# EAGLE design Preflightv1_18_2_12 (EAGLE 5.10)
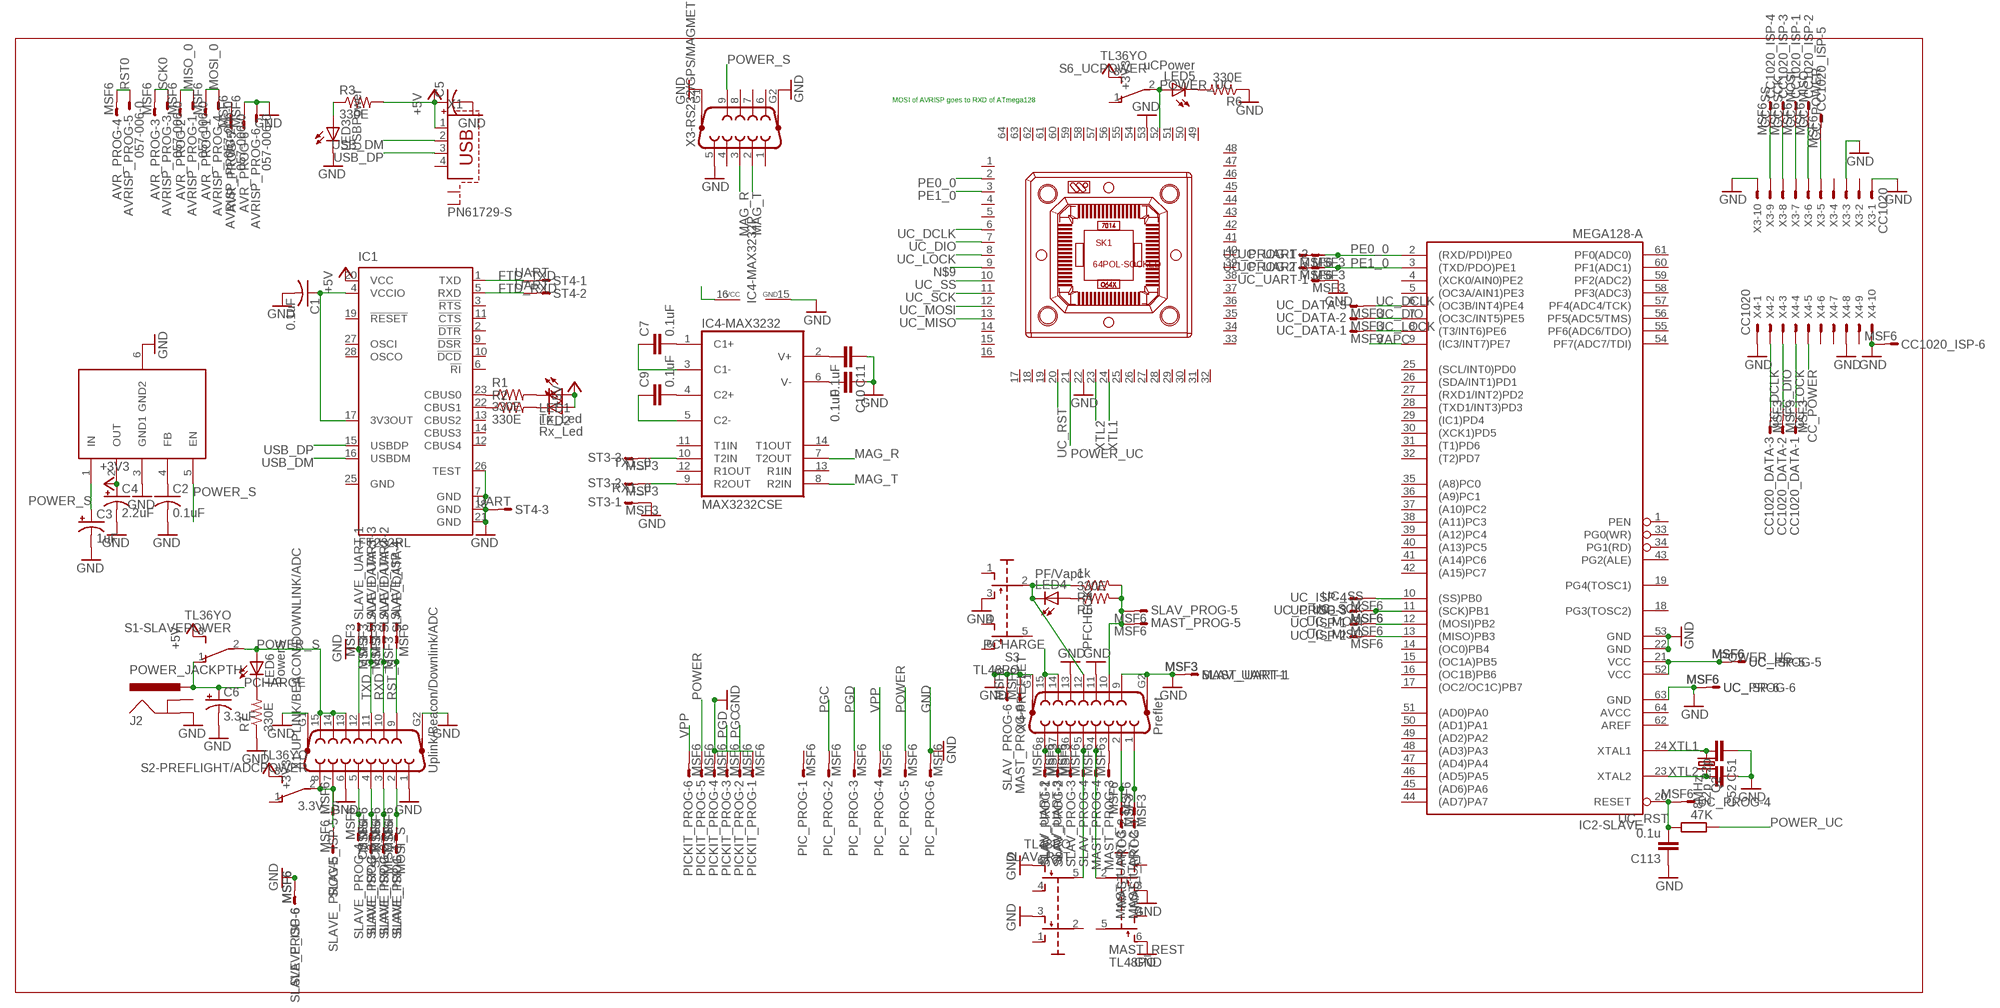
[diagram p0: schematic, sheet 1]

## Parts
AVR_PROG  MSF6  [MSF6]
AVRISP_PROG  057-006-0  ML6LE  [ML6L]
C1  0.1uF  C-USC1206K  [C1206K]
C2  0.1uF  C-USC1206K  [C1206K]
C3  1uF  CPOL-USCT3528  [CT3528]
C4  2.2uF  CPOL-USC/6032-28R  [C/6032-28R]
C5  CPOL-US153CLV-0405  [153CLV-0405]
C6  3.3uF  CPOL-US153CLV-0605  [153CLV-0605]
C7  0.1uF  C-EUC1206  [C1206]
C9  0.1uF  C-EUC1206  [C1206]
C10  0.1uF  C-EUC1206  [C1206]
C11  0.1uF  C-EUC1206  [C1206]
C51  22p  C-EUC1206  [C1206]
C52  22p  C-EUC1206  [C1206]
C113  0.1u  C-EUC1206  [C1206]
CC1020_DATA  MSF3  [MSF3]
CC1020_ISP  MSF6  [MSF6]
IC1  FT232RL  [SSOP28]
IC2-SLAVE  MEGA128-A  [TQFP64]
IC4-MAX3232  MAX3232CSE  [SO16]
J2  POWER_JACKPTH  [POWER_JACK_PTH]
LED1  Tx_Led  LEDCHIPLED_1206  [CHIPLED_1206]
LED2  Rx_Led  LEDCHIPLED_1206  [CHIPLED_1206]
LED3  USBPower  LEDCHIPLED_1206  [CHIPLED_1206]
LED4  PF/Vapc  LEDCHIPLED_1206  [CHIPLED_1206]
LED5  uCPower  LEDCHIPLED_1206  [CHIPLED_1206]
LED6  PowerS  LEDCHIPLED_1206  [CHIPLED_1206]
MAST_PROG  MSF6  [MSF6]
MAST_REST  TL48PO  [TL4XPO]
MAST_UART  MSF3  [MSF3]
PIC_PROG  MSF6  [MSF6]
PICKIT_PROG  MSF6  [MSF6]
Q2  8MHz  CRYSTALHC49S  [HC49/S]
R1  330E  R-US_M1206  [M1206]
R2  330E  R-US_M1206  [M1206]
R3  330E  R-US_M1206  [M1206]
R4  1k  R-US_M1206  [M1206]
R5  330E  R-US_M1206  [M1206]
R6  330E  R-US_M1206  [M1206]
R7  330E  R-US_M1206  [M1206]
R113  47K  R-EU_M1206  [M1206]
S1-SLAVEPOWER  TL36YO  [TL3XYO]
S2-PREFLIGHT/ADCPOWER  TL36YO  [TL3XYO]
S3  TL48PO  [TL4XPO]
S6_UCPOWER  TL36YO  [TL3XYO]
SK1  64POL-SOCKED  [QFP-SOCKED-64]
SLAV_PROG  MSF6  [MSF6]
SLAV_RST  TL48PO  [TL4XPO]
SLAV_UART  MSF3  [MSF3]
SLAVE_DATA  MSF3  [MSF3]
SLAVE_ISP  MSF6  [MSF6]
SLAVE_PROG  MSF6  [MSF6]
SLAVE_UART  MSF3  [MSF3]
ST3  MSF3  [MSF3]
ST4  UART  MSF3  [MSF3]
U$1  TPS73633  [SOT-223-5]
UC_DATA  MSF3  [MSF3]
UC_ISP  MSF6  [MSF6]
UC_PROG  MSF6  [MSF6]
UC_UART  MSF3  [MSF3]
X1  PN61729-S  [PN61729-S]
X1-UPLINK/BEACON/DOWNLINK/ADC  Uplink/Beacon/Downlink/ADC  F15HP  [F15HP]
X3  CC1020  C-GRID-10-70543  [70543-10]
X3-RS232/GPS/MAGMET  F09HP  [F09HP]
X4  CC1020  C-GRID-10-70543  [70543-10]
X4-PREFLET  Preflet  F15HP  [F15HP]

## Nets
3.3V_S: MAST_PROG.5 R4.2 R5.2 S2-PREFLIGHT/ADCPOWER.2(P) SLAV_PROG.5 SLAVE_ISP.5 SLAVE_PROG.5 X1-UPLINK/BEACON/DOWNLINK/ADC.7 X1-UPLINK/BEACON/DOWNLINK/ADC.8 X4-PREFLET.10
3V3OUT: C1.1 IC1.4(VCCIO) IC1.17(3V3OUT) IC4-MAX3232.16(VCC)
+3V3 [Power]: C4.+ S2-PREFLIGHT/ADCPOWER.3(S) S6_UCPOWER.3(S) U$1.2(OUT)
+5V: C5.+ IC1.20(VCC) LED1.A LED2.A R3.2 S1-SLAVEPOWER.3(S) X1.1
CC_DCLK: CC1020_DATA.3 X4.2
CC_DIO: CC1020_DATA.2 X4.3
CC_LOCK: CC1020_DATA.1 X4.4
CC_MISO: CC1020_ISP.2 X3.6
CC_MOSI: CC1020_ISP.1 X3.7
CC_POWER [Power]: CC1020_ISP.5 X3.5 X4.5
CC_SCK: CC1020_ISP.3 X3.8
CC_SS: CC1020_ISP.4 X3.9
CS_S: SLAVE_PROG.4 X1-UPLINK/BEACON/DOWNLINK/ADC.5
FTD_RXD: IC1.5(RXD) ST4.2
FTD_TXD: IC1.1(TXD) ST4.1
GND [Power]: AVR_PROG.6 AVRISP_PROG.6 C1.2 C2.2 C3.- C4.- C5.- C6.- C10.1 C11.1 C51.1 C52.1 C113.1 CC1020_ISP.6 IC1.7(GND) IC1.18(GND) IC1.21(GND) IC1.26(TEST) IC2-SLAVE.22(GND) IC2-SLAVE.53(GND) IC2-SLAVE.63(GND) IC4-MAX3232.15(GND) J2.GND LED3.C MAST_PROG.6 MAST_REST.3(S) MAST_REST.6(S1) MAST_UART.1 PIC_PROG.6 PICKIT_PROG.1 PICKIT_PROG.4 R6.1 R7.1 S3.3(S) SK1.22 SK1.53 SLAV_PROG.6 SLAV_RST.3(S) SLAV_RST.6(S1) SLAV_UART.1 SLAVE_ISP.6 SLAVE_PROG.6 SLAVE_UART.1 ST3.1 ST4.3 U$1.3(GND1) U$1.6(GND2) UC_ISP.6 UC_PROG.6 UC_UART.1 X1-UPLINK/BEACON/DOWNLINK/ADC.1 X1-UPLINK/BEACON/DOWNLINK/ADC.6 X1-UPLINK/BEACON/DOWNLINK/ADC.12 X1-UPLINK/BEACON/DOWNLINK/ADC.G1 X1-UPLINK/BEACON/DOWNLINK/ADC.G2 X3-RS232/GPS/MAGMET.5 X3-RS232/GPS/MAGMET.G1 X3-RS232/GPS/MAGMET.G2 X3.1 X3.3 X3.10 X4-PREFLET.9 X4-PREFLET.11 X4-PREFLET.13 X4-PREFLET.G1 X4-PREFLET.G2 X4.1 X4.8 X4.10
MAG_R: IC4-MAX3232.7(T2OUT) X3-RS232/GPS/MAGMET.3
MAG_T: IC4-MAX3232.8(R2IN) X3-RS232/GPS/MAGMET.2
MISO_0: AVR_PROG.2 AVRISP_PROG.1
MISO_S: SLAVE_ISP.2 SLAVE_PROG.2 X1-UPLINK/BEACON/DOWNLINK/ADC.3
MOSI_0: AVR_PROG.1 AVRISP_PROG.4
MOSI_S: SLAVE_ISP.1 SLAVE_PROG.1 X1-UPLINK/BEACON/DOWNLINK/ADC.2
N$1: LED5.C R6.2
N$2: IC1.23(CBUS0) R1.1
N$3: LED1.C R1.2
N$4: IC1.22(CBUS1) R2.1
N$5: LED2.C R2.2
N$6: LED3.A R3.1
N$7: C2.1 U$1.4(FB)
N$8: LED4.A R5.1
N$9: SK1.9
N$10: SLAV_PROG.1 SLAV_UART.2 X4-PREFLET.8
N$11: SLAV_PROG.2 SLAV_UART.3 X4-PREFLET.7
N$12: SLAV_PROG.3 X4-PREFLET.6
N$13: SLAV_PROG.4 SLAV_RST.5(P1) X4-PREFLET.5
N$14: MAST_PROG.1 MAST_UART.2 X4-PREFLET.1
N$15: MAST_PROG.2 MAST_UART.3 X4-PREFLET.2
N$16: MAST_PROG.3 X4-PREFLET.3
N$17: MAST_PROG.4 MAST_REST.2(P) X4-PREFLET.4
N$19: AVR_PROG.5 AVRISP_PROG.2
N$23: LED6.C R7.2
N$29: C7.2 IC4-MAX3232.1(C1+)
N$30: C7.1 IC4-MAX3232.3(C1-)
N$31: C9.2 IC4-MAX3232.4(C2+)
N$32: C9.1 IC4-MAX3232.5(C2-)
N$33: C11.2 IC4-MAX3232.2(V+)
N$34: C10.2 IC4-MAX3232.6(V-)
PCHARGE [Power]: C6.+ J2.PWR S1-SLAVEPOWER.1(O) X4-PREFLET.14 X4-PREFLET.15
PE0_0: IC2-SLAVE.2((RXD/PDI)PE0) SK1.2 UC_PROG.1 UC_UART.2
PE1_0: IC2-SLAVE.3((TXD/PDO)PE1) SK1.3 UC_PROG.2 UC_UART.3
PFCHECK: LED4.C R4.1 S3.2(P) X4-PREFLET.12
PGC: PIC_PROG.2 PICKIT_PROG.2
PGD: PIC_PROG.3 PICKIT_PROG.3
POWER: PIC_PROG.5 PICKIT_PROG.5
POWER_S: C3.+ LED6.A S1-SLAVEPOWER.2(P) U$1.1(IN) U$1.5(EN) X1-UPLINK/BEACON/DOWNLINK/ADC.13 X1-UPLINK/BEACON/DOWNLINK/ADC.14 X1-UPLINK/BEACON/DOWNLINK/ADC.15 X3-RS232/GPS/MAGMET.9
POWER_UC [Power]: IC2-SLAVE.21(VCC) IC2-SLAVE.52(VCC) LED5.A R113.1 S6_UCPOWER.2(P) SK1.21 SK1.52 UC_ISP.5 UC_PROG.5
RST0: AVR_PROG.4 AVRISP_PROG.5
RST_S: SLAVE_DATA.1 SLAVE_ISP.4 X1-UPLINK/BEACON/DOWNLINK/ADC.9
RX1_0: IC4-MAX3232.9(R2OUT) ST3.2
RXD_S: SLAVE_DATA.2 SLAVE_UART.2 X1-UPLINK/BEACON/DOWNLINK/ADC.10
SCK0: AVR_PROG.3 AVRISP_PROG.3
SCK_S: SLAVE_ISP.3 SLAVE_PROG.3 X1-UPLINK/BEACON/DOWNLINK/ADC.4
TX1_0: IC4-MAX3232.10(T2IN) ST3.3
TXD_S: SLAVE_DATA.3 SLAVE_UART.3 X1-UPLINK/BEACON/DOWNLINK/ADC.11
UC_DCLK: IC2-SLAVE.6((OC3B/INT4)PE4) SK1.6 UC_DATA.3
UC_DIO: IC2-SLAVE.7((OC3C/INT5)PE5) SK1.7 UC_DATA.2
UC_LOCK: IC2-SLAVE.8((T3/INT6)PE6) SK1.8 UC_DATA.1
UC_MISO: IC2-SLAVE.13((MISO)PB3) SK1.13 UC_ISP.2
UC_MOSI: IC2-SLAVE.12((MOSI)PB2) SK1.12 UC_ISP.1
UC_RST: C113.2 IC2-SLAVE.20(RESET) R113.2 SK1.20 UC_PROG.4
UC_SCK: IC2-SLAVE.11((SCK)PB1) SK1.11 UC_ISP.3 UC_PROG.3
UC_SS: IC2-SLAVE.10((SS)PB0) SK1.10 UC_ISP.4
USB_DM: IC1.16(USBDM) X1.2
USB_DP: IC1.15(USBDP) X1.3
VAPC: IC2-SLAVE.9((IC3/INT7)PE7)
VPP: PIC_PROG.4 PICKIT_PROG.6
XTL1: C51.2 IC2-SLAVE.24(XTAL1) Q2.1 SK1.24
XTL2: C52.2 IC2-SLAVE.23(XTAL2) Q2.2 SK1.23
Unconnected: IC1.2(!DTR) IC1.3(!RTS) IC1.6(!RI) IC1.9(!DSR) IC1.10(!DCD) IC1.11(!CTS) IC1.12(CBUS4) IC1.13(CBUS2) IC1.14(CBUS3) IC1.19(!RESET) IC1.27(OSCI) IC1.28(OSCO) IC2-SLAVE.1(PEN) IC2-SLAVE.4((XCK0/AIN0)PE2) IC2-SLAVE.5((OC3A/AIN1)PE3) IC2-SLAVE.14((OC0)PB4) IC2-SLAVE.15((OC1A)PB5) IC2-SLAVE.16((OC1B)PB6) IC2-SLAVE.17((OC2/OC1C)PB7) IC2-SLAVE.18(PG3(TOSC2)) IC2-SLAVE.19(PG4(TOSC1)) IC2-SLAVE.25((SCL/INT0)PD0) IC2-SLAVE.26((SDA/INT1)PD1) IC2-SLAVE.27((RXD1/INT2)PD2) IC2-SLAVE.28((TXD1/INT3)PD3) IC2-SLAVE.29((IC1)PD4) IC2-SLAVE.30((XCK1)PD5) IC2-SLAVE.31((T1)PD6) IC2-SLAVE.32((T2)PD7) IC2-SLAVE.33(PG0(WR)) IC2-SLAVE.34(PG1(RD)) IC2-SLAVE.35((A8)PC0) IC2-SLAVE.36((A9)PC1) IC2-SLAVE.37((A10)PC2) IC2-SLAVE.38((A11)PC3) IC2-SLAVE.39((A12)PC4) IC2-SLAVE.40((A13)PC5) IC2-SLAVE.41((A14)PC6) IC2-SLAVE.42((A15)PC7) IC2-SLAVE.43(PG2(ALE)) IC2-SLAVE.44((AD7)PA7) IC2-SLAVE.45((AD6)PA6) IC2-SLAVE.46((AD5)PA5) IC2-SLAVE.47((AD4)PA4) IC2-SLAVE.48((AD3)PA3) IC2-SLAVE.49((AD2)PA2) IC2-SLAVE.50((AD1)PA1) IC2-SLAVE.51((AD0)PA0) IC2-SLAVE.54(PF7(ADC7/TDI)) IC2-SLAVE.55(PF6(ADC6/TDO)) IC2-SLAVE.56(PF5(ADC5/TMS)) IC2-SLAVE.57(PF4(ADC4/TCK)) IC2-SLAVE.58(PF3(ADC3)) IC2-SLAVE.59(PF2(ADC2)) IC2-SLAVE.60(PF1(ADC1)) IC2-SLAVE.61(PF0(ADC0)) IC2-SLAVE.62(AREF) IC4-MAX3232.11(T1IN) IC4-MAX3232.12(R1OUT) IC4-MAX3232.13(R1IN) IC4-MAX3232.14(T1OUT) J2.GNDBREAK MAST_REST.1(O) MAST_REST.4(O1) MAST_REST.5(P1) PIC_PROG.1 S2-PREFLIGHT/ADCPOWER.1(O) S3.1(O) S3.4(O1) S3.5(P1) S3.6(S1) S6_UCPOWER.1(O) SK1.1 SK1.4 SK1.5 SK1.14 SK1.15 SK1.16 SK1.17 SK1.18 SK1.19 SK1.25 SK1.26 SK1.27 SK1.28 SK1.29 SK1.30 SK1.31 SK1.32 SK1.33 SK1.34 SK1.35 SK1.36 SK1.37 SK1.38 SK1.39 SK1.40 SK1.41 SK1.42 SK1.43 SK1.44 SK1.45 SK1.46 SK1.47 SK1.48 SK1.49 SK1.50 SK1.51 SK1.54 SK1.55 SK1.56 SK1.57 SK1.58 SK1.59 SK1.60 SK1.61 SK1.62 SK1.63 SK1.64 SLAV_RST.1(O) SLAV_RST.2(P) SLAV_RST.4(O1) X1.4 X1.S1 X1.S2 X3-RS232/GPS/MAGMET.1 X3-RS232/GPS/MAGMET.4 X3-RS232/GPS/MAGMET.6 X3-RS232/GPS/MAGMET.7 X3-RS232/GPS/MAGMET.8 X3.2 X3.4 X4.6 X4.7 X4.9

## Notes on the sheet
- MOSI of AVRISP goes to RXD of ATmega128

## Power pins joined to a net without a drawn wire
AVCC: IC2-SLAVE.64(AVCC)
GND: IC1.25(GND)

## Library data of the parts
AVR_PROG CC1020_ISP MAST_PROG PIC_PROG PICKIT_PROG SLAV_PROG SLAVE_ISP SLAVE_PROG UC_ISP UC_PROG = con-lumberg:MSF6: MSF CONNECTOR
AVRISP_PROG = con-ml:ML6LE: HARTING
C1 C2 = rcl:C-US: CAPACITOR, American symbol
C3-C6 = rcl:CPOL-US: POLARIZED CAPACITOR, American symbol
C7 C9-C11 C51 C52 C113 = rcl:C-EU: CAPACITOR, European symbol
CC1020_DATA MAST_UART SLAV_UART SLAVE_DATA SLAVE_UART ST3 ST4 UC_DATA UC_UART = con-lumberg:MSF3: MSF CONNECTOR
IC1 = ftdichip:FT232R: Source: http://www.ftdichip.com/Documents/DataSheets/DS_FT232R_v104.pdf
IC2-SLAVE = satellite:MEGA128: MICROCONTROLLER 128 Kbytes FLASH 4 Kbytes SRAM 4 Kbytes EEPROM DUAL USART 8-channel 10 bit ADC Source: avr.lbr
IC4-MAX3232 = satellite:MAX3232*: True RS-232 Transceivers 3.0V to 5.5V, Low-Power up to 1Mbps, Using Four 0.1µF External Capacitors Source: http://pdfserv.maxim-ic.com/en/ds/MAX3222-MAX3241.pdf
J2 = SparkFun:POWER_JACK: Power Jack This is the standard 5.5mm barrel jack for power. The PTH is the most common, proven, reliable, footprint. All others are experimental. The Slot footprint only works if the mill layer is transmitted to the PCB fab house so be warned. Spark Fun Electronics SKU : PRT-00119. Mating wall wart : TOL-00298 (and others)
LED1-LED6 = led:LED: LED OSRAM: - CHIPLED LG R971, LG N971, LY N971, LG Q971, LY Q971, LO R971, LY R971 LH N974, LH R974 LS Q976, LO Q976, LY Q976 LO Q996 - Hyper CHIPLED LW Q18S LB Q993, LB Q99A, LB R99A - SideLED LS A670, LO A670, LY A670, LG A670, LP A670 LB A673, LV A673, LT A673, LW A673 LH A674 LY A675 LS A676, LA A676, LO A676, LY A676, LW A676 LS A679, LY A679, LG A679 - Hyper Micro SIDELED® LS Y876, LA Y876, LO Y876, LY Y876 LT Y87S - SmartLED LW L88C, LW L88S LB L89C, LB L89S, LG L890 LS L89K, LO L89K, LY L89K LS L896, LA L896, LO L896, LY L896 - TOPLED LS T670, LO T670, LY T670, LG T670, LP T670 LSG T670, LSP T670, LSY T670, LOP T670, LYG T670 LG T671, LOG T671, LSG T671 LB T673, LV T673, LT T673, LW T673 LH T674 LS T676, LA T676, LO T676, LY T676, LB T676, LH T676, LSB T676, LW T676 LB T67C, LV T67C, LT T67C, LS T67K, LO T67K, LY T67K, LW E67C LS E67B, LA E67B, LO E67B, LY E67B, LB E67C, LV E67C, LT E67C LW T67C LS T679, LY T679, LG T679 LS T770, LO T770, LY T770, LG T770, LP T770 LB T773, LV T773, LT T773, LW T773 LH T774 LS E675, LA E675, LY E675, LS T675 LS T776, LA T776, LO T776, LY T776, LB T776 LHGB T686 LT T68C, LB T68C - Hyper Mini TOPLED® LB M676 - Mini TOPLED Santana® LG M470 LS M47K, LO M47K, LY M47K Source: http://www.osram.convergy.de LUXEON: - LUMILED® LXK2-PW12-R00, LXK2-PW12-S00, LXK2-PW14-U00, LXK2-PW14-V00 LXK2-PM12-R00, LXK2-PM12-S00, LXK2-PM14-U00 LXK2-PE12-Q00, LXK2-PE12-R00, LXK2-PE12-S00, LXK2-PE14-T00, LXK2-PE14-U00 LXK2-PB12-K00, LXK2-PB12-L00, LXK2-PB12-M00, LXK2-PB14-N00, LXK2-PB14-P00, LXK2-PB14-Q00 LXK2-PR12-L00, LXK2-PR12-M00, LXK2-PR14-Q00, LXK2-PR14-R00 LXK2-PD12-Q00, LXK2-PD12-R00, LXK2-PD12-S00 LXK2-PH12-R00, LXK2-PH12-S00 LXK2-PL12-P00, LXK2-PL12-Q00, LXK2-PL12-R00 Source: www.luxeon.com KINGBRIGHT: KA-3528ASYC Source: www.kingbright.com
MAST_REST S3 SLAV_RST = switch:TL48PO: TINY SWITCH ON OFF MOM Source: http://www2.produktinfo.conrad.com/datenblaetter/700000-724999/705152-da-01-de-Subminiaturschalter_TL_36YO.pdf
Q2 = crystal:CRYSTAL: CRYSTAL
R1-R7 = rcl:R-US_: RESISTOR, American symbol
R113 = resistor:R-EU_: RESISTOR, European symbol
S1-SLAVEPOWER S2-PREFLIGHT/ADCPOWER S6_UCPOWER = switch:TL36YO: TINY SWITCH ON - ON Source: http://www2.produktinfo.conrad.com/datenblaetter/700000-724999/705152-da-01-de-Subminiaturschalter_TL_36YO.pdf
SK1 = advanced-test-technologies:64POL-SOCKED: QFP SOCKED 64 pol. Source: WELLS CTI 7014-064-6-08 TQFP 64 - Drawing.pdf
U$1 = satellite:TPS73633
X1 = con-berg:PN61729-S: BERG USB connector
X1-UPLINK/BEACON/DOWNLINK/ADC X4-PREFLET = satellite:F15HP: SUB-D
X3 X4 = con-molex:C-GRID-10: CONNECTOR wire to board 2.54 mm (0.100") pitch header
X3-RS232/GPS/MAGMET = satellite:F09HP: SUB-D

## Net classes
1 Power: width 0.254 mm, clearance 0.508 mm to class 0, clearance 0.508 mm

## Board
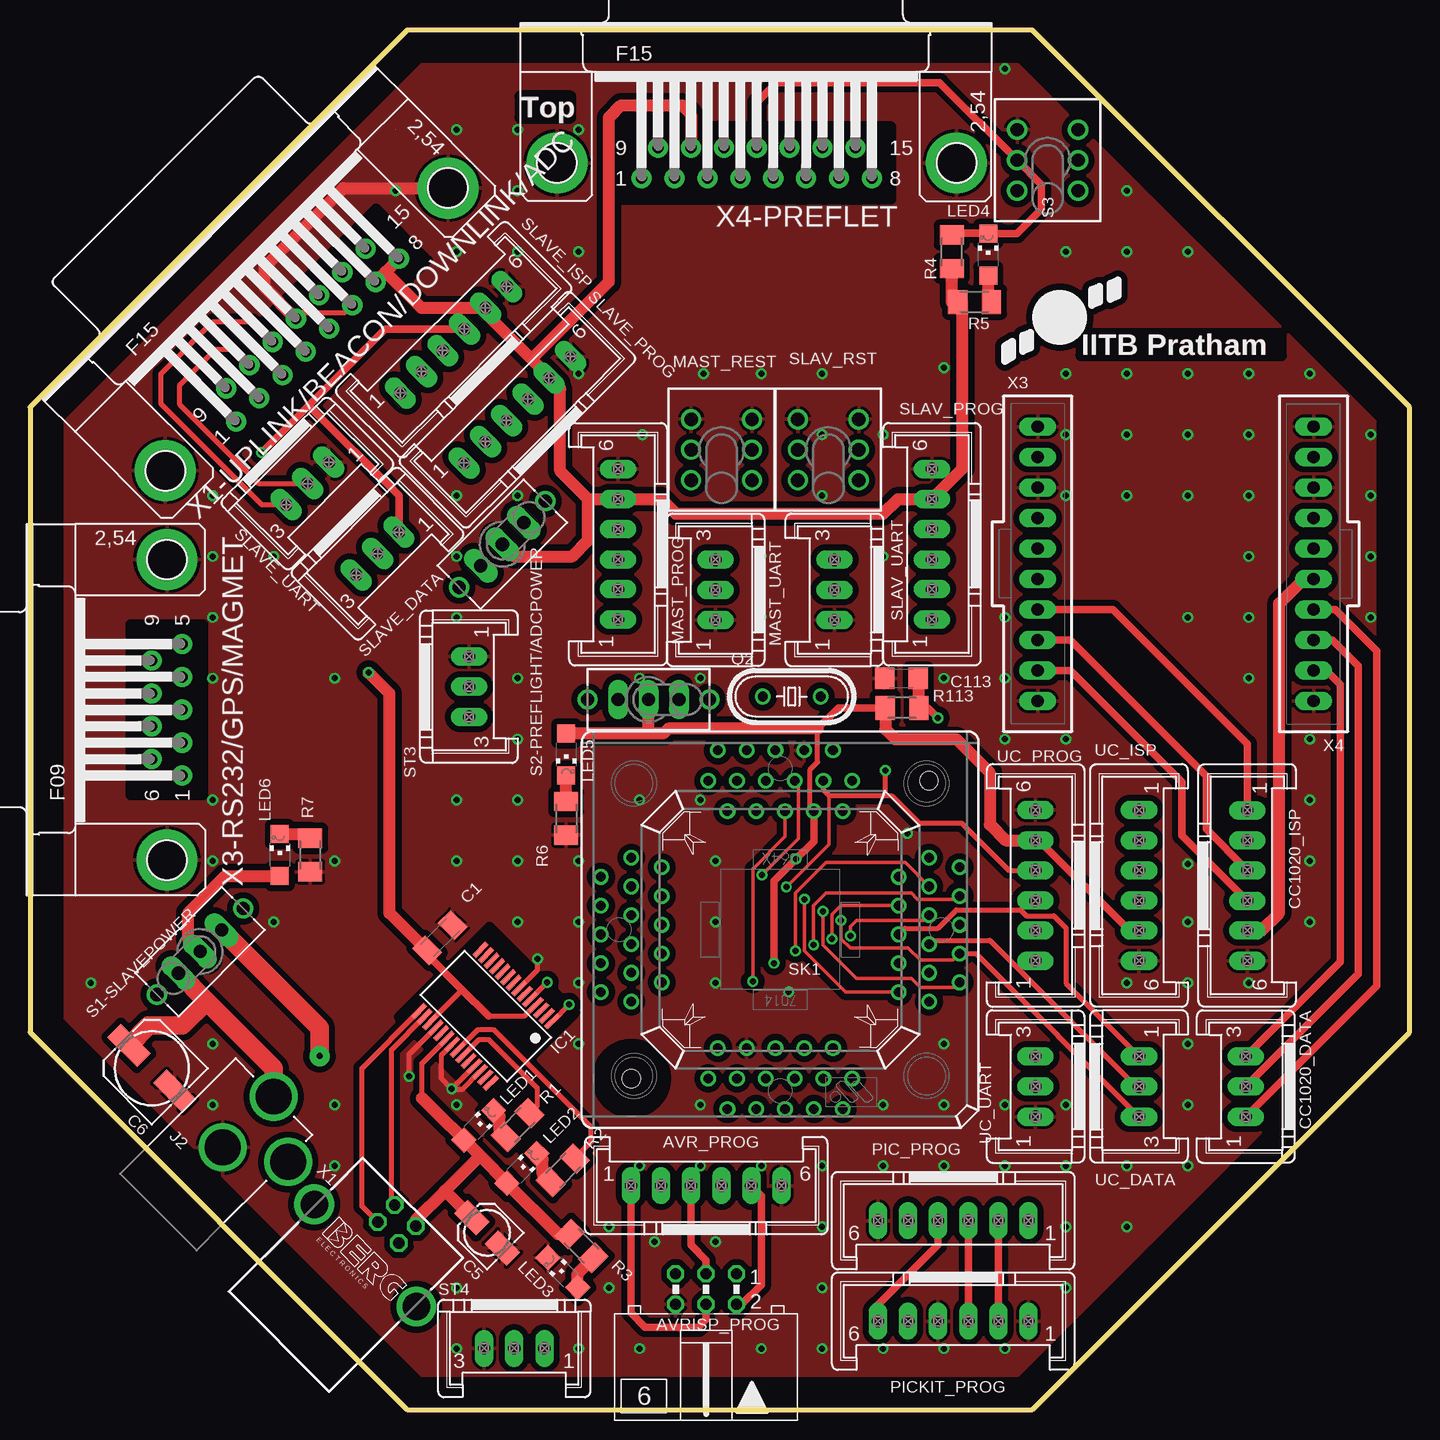
[diagram p1: board, top side]
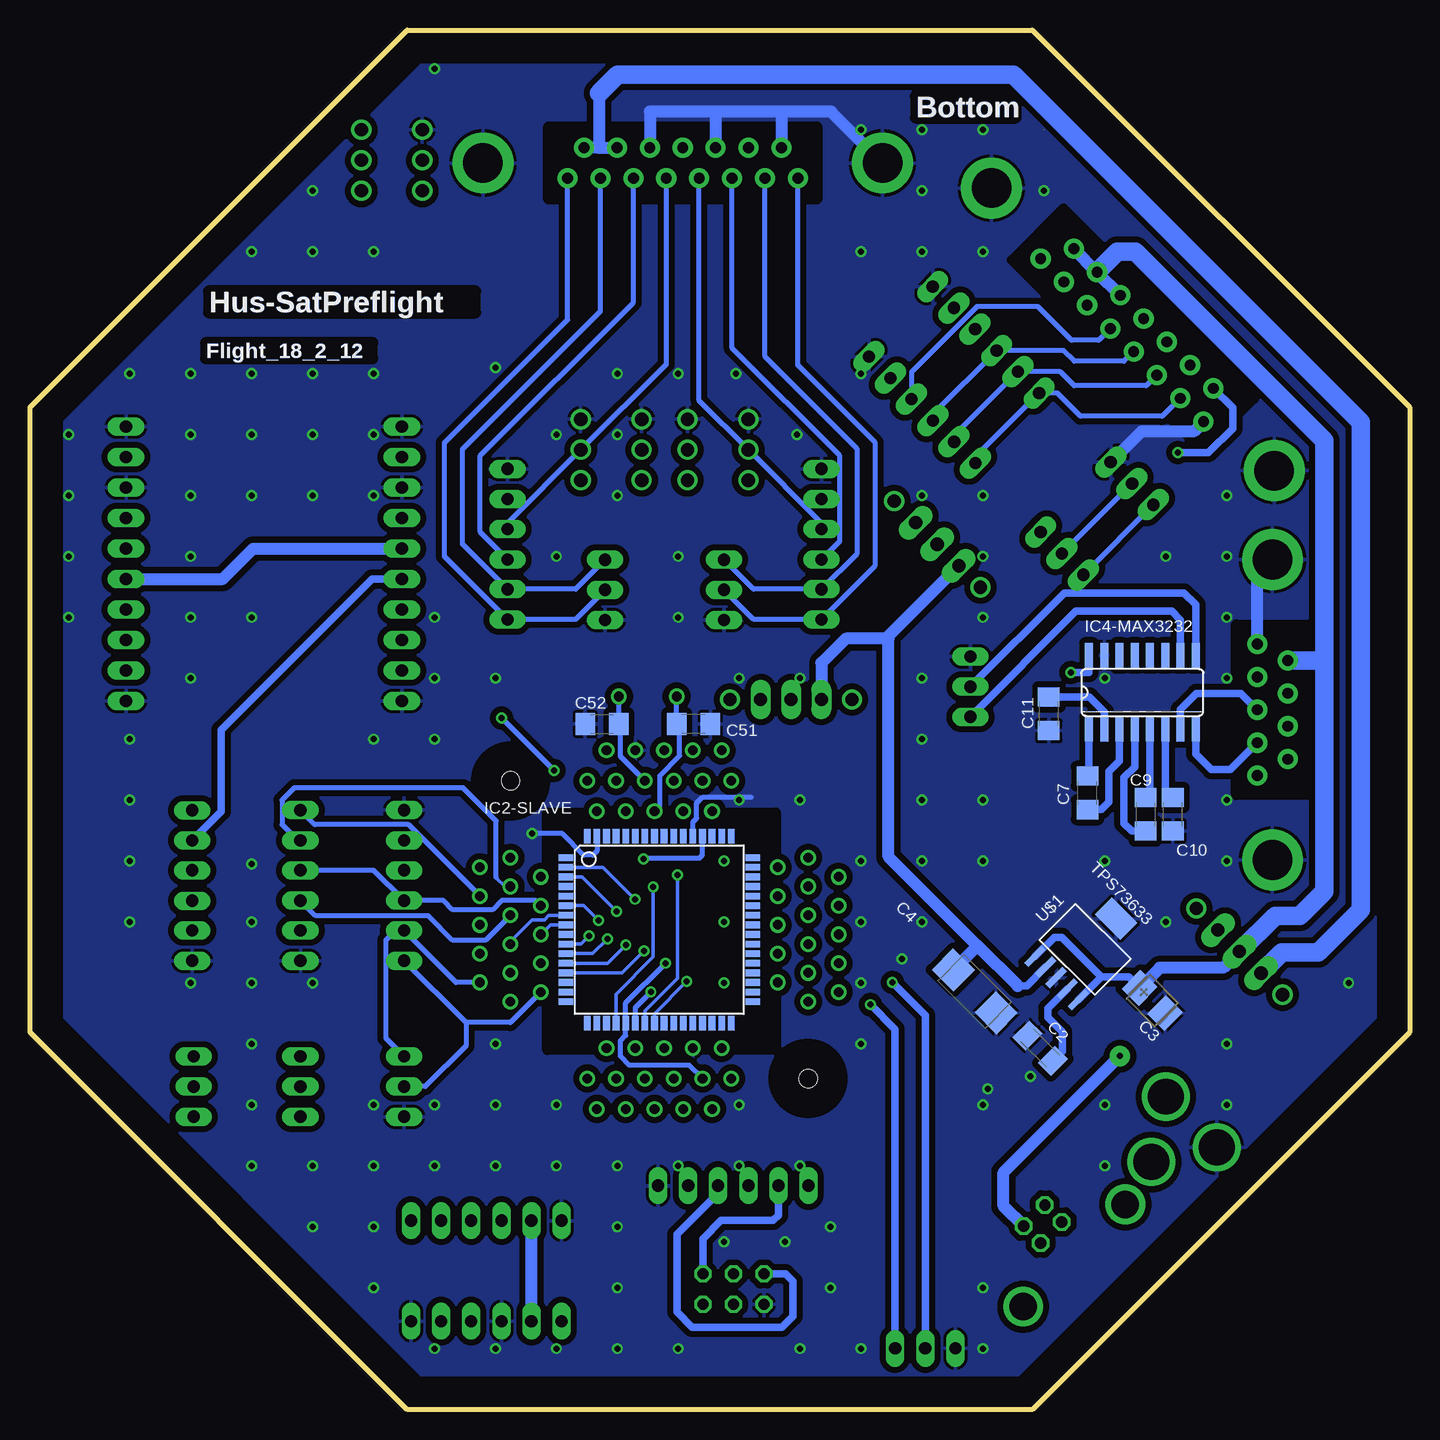
[diagram p2: board, bottom side, seen from below]

Size 115 x 115 mm. Coordinates in mm from the lower left corner, seen from the top.
Outline: 115,83.55 83.55,115 31.45,115 0,83.55 0,31.45 31.45,0 83.55,0 115,31.45 115,83.55
Copper layers (1*16): Top 0.07mm / dielectric 1.5mm / Bottom 0.07mm
Design rules "satellite": minimum track width 10mil, minimum drill 20mil, track to track 6mil, track to pad 6mil, pad to pad 6mil, via to via 6mil, smd to smd 6mil, copper to edge 100mil, drill to drill 8mil, minimum pad ring 10mil, minimum via ring 8mil, stop-mask expansion 4mil, vias tented up to drill 0mil, thermal gap 10mil
tRestrict: area 30.7,25.5 to 45.5,40.3
bRestrict: area 52.8,30 to 71.9,49.8
vRestrict: area 81,55 to 110,87

### Footprints (pad centres in the part's own frame; a part is rotated, then mirrored left to right if it is on the bottom)
MSF6 = drill 1.016 long: 1 6.274,-2.54; 2 3.759,-2.54; 3 1.27,-2.54; 4 -1.27,-2.54; 5 -3.759,-2.54; 6 -6.274,-2.54
ML6L = drill 0.914 octagon: 1 -2.54,-1.27; 2 -2.54,1.27; 3 0,-1.27; 4 0,1.27; 5 2.54,-1.27; 6 2.54,1.27
C1206K = smd 1.5 x 2: 1 -1.5,0; 2 1.5,0
CT3528 = smd 2 x 2.2: + -1.5,0; - 1.5,0
C/6032-28R = smd 2.55 x 2.5: + 2.525,0; - -2.525,0
153CLV-0405 = smd 2.6 x 1.6: + 1.8,0; - -1.8,0
153CLV-0605 = smd 3.5 x 1.6: + 2.7,0; - -2.7,0
C1206 = smd 1.6 x 1.8: 1 -1.4,0; 2 1.4,0
MSF3 = drill 1.016 long: 1 2.515,-2.54; 2 0,-2.54; 3 -2.515,-2.54
SSOP28 = smd 0.4 x 1.5: 1 -4.225,-3.625; 2 -3.575,-3.625; 3 -2.925,-3.625; 4 -2.275,-3.625; 5 -1.625,-3.625; 6 -0.975,-3.625; 7 -0.325,-3.625; 8 0.325,-3.625; 9 0.975,-3.625; 10 1.625,-3.625; 11 2.275,-3.625; 12 2.925,-3.625; 13 3.575,-3.625; 14 4.225,-3.625; 15 4.225,3.625; 16 3.575,3.625; 17 2.925,3.625; 18 2.275,3.625; 19 1.625,3.625; 20 0.975,3.625; 21 0.325,3.625; 22 -0.325,3.625; 23 -0.975,3.625; 24 -1.625,3.625; 25 -2.275,3.625; 26 -2.925,3.625; 27 -3.575,3.625; 28 -4.225,3.625
TQFP64 = smd 1.194 x 0.559: 1 -7.8,6; 2 -7.8,5.2; 3 -7.8,4.4; 4 -7.8,3.6; 5 -7.8,2.8; 6 -7.8,2; 7 -7.8,1.2; 8 -7.8,0.4; 9 -7.8,-0.4; 10 -7.8,-1.2; 11 -7.8,-2; 12 -7.8,-2.8; 13 -7.8,-3.6; 14 -7.8,-4.4; 15 -7.8,-5.2; 16 -7.8,-6; 33 7.8,-6; 34 7.8,-5.2; 35 7.8,-4.4; 36 7.8,-3.6; 37 7.8,-2.8; 38 7.8,-2; 39 7.8,-1.2; 40 7.8,-0.4; 41 7.8,0.4; 42 7.8,1.2; 43 7.8,2; 44 7.8,2.8; 45 7.8,3.6; 46 7.8,4.4; 47 7.8,5.2; 48 7.8,6 | smd 0.559 x 1.194: 17 -6,-7.8; 18 -5.2,-7.8; 19 -4.4,-7.8; 20 -3.6,-7.8; 21 -2.8,-7.8; 22 -2,-7.8; 23 -1.2,-7.8; 24 -0.4,-7.8; 25 0.4,-7.8; 26 1.2,-7.8; 27 2,-7.8; 28 2.8,-7.8; 29 3.6,-7.8; 30 4.4,-7.8; 31 5.2,-7.8; 32 6,-7.8; 49 6,7.8; 50 5.2,7.8; 51 4.4,7.8; 52 3.6,7.8; 53 2.8,7.8; 54 2,7.8; 55 1.2,7.8; 56 0.4,7.8; 57 -0.4,7.8; 58 -1.2,7.8; 59 -2,7.8; 60 -2.8,7.8; 61 -3.6,7.8; 62 -4.4,7.8; 63 -5.2,7.8; 64 -6,7.8
SO16 = smd 0.66 x 2.032: 1 -4.445,-3.073; 2 -3.175,-3.073; 3 -1.905,-3.073; 4 -0.635,-3.073; 5 0.635,-3.073; 6 1.905,-3.073; 7 3.175,-3.073; 8 4.445,-3.073; 9 4.445,3.073; 10 3.175,3.073; 11 1.905,3.073; 12 0.635,3.073; 13 -0.635,3.073; 14 -1.905,3.073; 15 -3.175,3.073; 16 -4.445,3.073
POWER_JACK_PTH = drill 2.997 round: GND 0,7.7; GNDBREAK 4.7,10.7; PWR 0,13.7
CHIPLED_1206 = smd 1.5 x 1.5: A 0,-1.75; C 0,1.75
TL4XPO = drill 1.1 pad 1.676 round: 1 -2.54,2.54; 2 0,2.54; 3 2.54,2.54; 4 -2.54,-2.54; 5 0,-2.54; 6 2.54,-2.54
HC49/S = drill 0.813 round: 1 -2.413,0; 2 2.413,0
M1206 = smd 1.6 x 2: 1 -1.4,0; 2 1.4,0
TL3XYO = drill 1.1 pad 1.422 long: 1 -2.54,0; 2 0,0; 3 2.54,0 | drill 1.1 pad 1.676 round: M1 -5.08,0; M2 5.08,0
QFP-SOCKED-64 = drill 0.8 pad 1.2 round: 1 -12.41,6; 2 -9.87,5.2; 3 -14.95,4.4; 4 -12.41,3.6; 5 -9.87,2.8; 6 -14.95,2; 7 -12.41,1.2; 8 -9.87,0.4; 9 -14.95,-0.4; 10 -12.41,-1.2; 11 -9.87,-2; 12 -14.95,-2.8; 13 -12.41,-3.6; 14 -9.87,-4.4; 15 -14.95,-5.2; 16 -12.41,-6; 17 -6,-12.41; 18 -5.2,-9.87; 19 -4.4,-14.95; 20 -3.6,-12.41; 21 -2.8,-9.87; 22 -2,-14.95; 23 -1.2,-12.41; 24 -0.4,-9.87; 25 0.4,-14.95; 26 1.2,-12.41; 27 2,-9.87; 28 2.8,-14.95; 29 3.6,-12.41; 30 4.4,-9.87; 31 5.2,-14.95; 32 6,-12.41; 33 12.41,-6; 34 9.87,-5.2; 35 14.95,-4.4; 36 12.41,-3.6; 37 9.87,-2.8; 38 14.95,-2; 39 12.41,-1.2; 40 9.87,-0.4; 41 14.95,0.4; 42 12.41,1.2; 43 9.87,2; 44 14.95,2.8; 45 12.41,3.6; 46 9.87,4.4; 47 14.95,5.2; 48 12.41,6; 49 6,12.41; 50 5.2,9.87; 51 4.4,14.95; 52 3.6,12.41; 53 2.8,9.87; 54 2,14.95; 55 1.2,12.41; 56 0.4,9.87; 57 -0.4,14.95; 58 -1.2,12.41; 59 -2,9.87; 60 -2.8,14.95; 61 -3.6,12.41; 62 -4.4,9.87; 63 -5.2,14.95; 64 -6,12.41 | hole 1.5: -12.41,-12.41; 12.41,12.41
SOT-223-5 = smd 0.5 x 2: 1 -2.54,-2.75; 2 -1.29,-2.75; 3 -0.04,-2.75; 4 1.29,-2.75; 5 2.58,-2.75 | smd 3 x 2: 6 0,4.25
PN61729-S = drill 0.95 octagon: 1 1.25,4.71; 2 -1.25,4.71; 3 -1.25,2.71; 4 1.25,2.71 | drill 2.3 pad 2.9 round: S1 -6.02,0; S2 6.02,0
F15HP = drill 0.9 pad 1.676 round: 1 -9.601,-1.27; 2 -6.858,-1.27; 3 -4.115,-1.27; 4 -1.372,-1.27; 5 1.372,-1.27; 6 4.115,-1.27; 7 6.858,-1.27; 8 9.601,-1.27; 9 -8.23,1.27; 10 -5.486,1.27; 11 -2.743,1.27; 12 0,1.27; 13 2.743,1.27; 14 5.486,1.27; 15 8.23,1.27 | drill 3.302 pad 5.08 round: G1 16.662,0; G2 -16.662,0
70543-10 = drill 1.016 long: 1 -11.43,0; 2 -8.89,0; 3 -6.35,0; 4 -3.81,0; 5 -1.27,0; 6 1.27,0; 7 3.81,0; 8 6.35,0; 9 8.89,0; 10 11.43,0
F09HP = drill 0.9 pad 1.676 round: 1 -5.486,-1.27; 2 -2.743,-1.27; 3 0,-1.27; 4 2.743,-1.27; 5 5.486,-1.27; 6 -4.115,1.27; 7 -1.372,1.27; 8 1.372,1.27; 9 4.115,1.27 | drill 3.302 pad 5.08 round: G1 -12.522,0; G2 12.522,0

### Placement (x,y rotation side)
AVR_PROG  56.37,16.12 180 top
AVRISP_PROG  56.37,10.03 180 top
C1  34.16,39.32 45 top
C2  30.79,30.12 135 bottom
C3  21.44,34.09 315 bottom
C4  36.25,34.86 135 bottom
C5  38.1,14.73 135 top
C6  10.16,28.45 135 top
C7  26.84,51.4 90 bottom
C9  22.02,49.63 270 bottom
C10  19.73,49.63 90 bottom
C11  30.07,57.99 90 bottom
C51  59.69,57.15 180 bottom
C52  67.31,57.15 0 bottom
C113  72.64,60.96 0 top
CC1020_DATA  103.89,26.92 270 top
CC1020_ISP  98.93,43.68 90 top
IC1  37.99,32.79 135 top
IC2-SLAVE  62.54,40 0 bottom
IC4-MAX3232  22.27,59.79 0 bottom
J2  10.63,16.4 315 top
LED1  37.41,23.7 315 top
LED2  41,20.11 315 top
LED3  44.42,11.42 45 top
LED4  79.88,96.26 0 top
LED5  44.7,54.61 180 top
LED6  20.83,46.23 0 top
MAST_PROG  51.56,72.14 270 top
MAST_REST  57.66,80.01 90 top
MAST_UART  59.69,68.33 270 top
PIC_PROG  76.96,18.29 0 top
PICKIT_PROG  76.96,9.91 0 top
Q2  63.5,59.44 0 top
R1  40.65,23.71 225 top
R2  44.42,19.94 225 top
R3  45.97,13.64 135 top
R4  76.83,96.52 270 top
R5  78.74,92.33 180 top
R6  44.7,49.28 90 top
R7  23.37,46.23 90 top
R113  72.69,58.5 0 top
S1-SLAVEPOWER  14.18,38.18 45 top
S2-PREFLIGHT/ADCPOWER  39.37,72.13 225 top
S3  84.84,104.14 90 top
S6_UCPOWER  51.56,59.18 180 top
SK1  62.54,40 180 top
SLAV_PROG  77.72,72.14 270 top
SLAV_RST  66.55,80.01 90 top
SLAV_UART  69.6,68.33 270 top
SLAVE_DATA  27.18,73.15 45 top
SLAVE_ISP  37.11,87.38 225 top
SLAVE_PROG  42.42,81.53 225 top
SLAVE_UART  21.34,78.99 45 top
ST3  34.06,60.26 90 top
ST4  40.37,7.63 0 top
U$1  27.48,37.91 315 bottom
UC_DATA  89.92,26.92 90 top
UC_ISP  89.92,43.69 90 top
UC_PROG  86.36,43.69 270 top
UC_UART  86.36,26.92 270 top
X1  27.95,12.84 315 top
X1-UPLINK/BEACON/DOWNLINK/ADC  23.06,90.04 45 top
X3  84,70.5 270 top
X3-RS232/GPS/MAGMET  11.42,58.33 90 top
X4  107,70.5 90 top
X4-PREFLET  60.58,103.92 0 top

### Tracks (layer width: path | path; a pad name or v marks a point on that pad's centre or on a via)
3.3V_S
  Top 1.016: X4-PREFLET.10 55.1,107.97 54.36,108.71 49.28,108.71 48.26,107.7 48.26,93.98 48.24,93.98 41.82,87.56 | R4.2 76.83,92.33 R5.2 77.72,92.33 77.72,78.44 SLAV_PROG.5 72.34,75.89 71.12,74.68 53.85,74.68 52.63,75.89 MAST_PROG.5 46.53,75.89 | 29.64,94.82 X1-UPLINK/BEACON/DOWNLINK/ADC.7 | 29.64,94.82 X1-UPLINK/BEACON/DOWNLINK/ADC.8 | 29.64,94.82 32.63,91.83 SLAVE_ISP.5 37.97,91.4 41.82,87.56 | 46.53,75.89 44.2,78.23 44.2,85.07 SLAVE_PROG.5 43.28,86.09 41.82,87.56 | S2-PREFLIGHT/ADCPOWER.2 40.38,71.12 45.21,71.12 46.53,72.44 46.53,75.89
3V3OUT  (via drill 0.5)
  Top 0.406: IC1.4 41.22,32.8 38.21,32.8 | IC1.17 36.04,34.97
  Top 0.61: 38.21,32.8 36.04,34.97 32.92,38.08 C1.1
  Top 1.016: C1.1 29.97,41.39 29.97,59.69 v28.23,61.44
  Bottom 0.61: IC4-MAX3232.16 26.71,61.44 v28.23,61.44
+3V3
  Bottom 0.61: U$1.2 31.91,35.31 32.67,35.31
  Bottom 1.016: 32.67,35.31 36.02,38.66 | C4.+ 36.02,38.66 | 36.02,38.66 43.43,46.08 43.43,64.26 | 43.43,64.26 43.43,64.48 S2-PREFLIGHT/ADCPOWER.3 | S6_UCPOWER.3 49.02,62.23 46.99,64.26 43.43,64.26
+5V  (via drill 0.5 pad 1.68)
  Top 0.406: IC1.20 32.68,28.85 32.68,25.95
  Top 1.016: 37.5,21.13 LED2.A 44.01,14.63 R3.2 | 37.5,21.13 32.68,25.95 | 37.5,21.13 LED1.A | 34.6,18.23 37.5,21.13 | C5.+ 34.6,18.23 | 34.6,18.23 32.17,15.79 X1.1
  Top 1.524: v24.13,29.46 24.13,31.82 S1-SLAVEPOWER.3
  Bottom 1.016: v24.13,29.46 33.84,19.75 33.84,16.96 X1.1
CC_DCLK
  Top 0.61: X4.2 108.06,61.61 109.22,60.45 109.22,37.31 CC1020_DATA.3
CC_DIO
  Top 0.61: X4.3 108.57,64.15 110.74,61.98 110.74,36.32 CC1020_DATA.2
CC_LOCK
  Top 0.61: X4.4 108.82,66.69 112.27,63.25 112.27,35.33 CC1020_DATA.1
CC_MISO
  Bottom 0.61: X3.6 86.47,69.23 99.06,56.64 99.06,49.85 CC1020_ISP.2
CC_MOSI
  Top 0.61: X3.7 90.28,66.69 101.47,55.5 CC1020_ISP.1
CC_POWER
  Top 1.016: CC1020_ISP.5 102.66,39.92 104.14,41.4 104.14,67.2 106.17,69.23 X4.5
  Bottom 1.016: X4.5 98.92,69.23 96.38,71.77 X3.5
CC_SCK
  Top 0.61: X3.8 86.73,64.15 98.04,52.83 98.04,48.38 CC1020_ISP.3
CC_SS
  Top 0.61: X3.9 86.73,61.61 96.01,52.32 96.01,47.87 CC1020_ISP.4
CS_S
  Bottom 0.406: X1-UPLINK/BEACON/DOWNLINK/ADC.5 25.91,89.14 28.18,89.14 30.99,91.95 36.07,91.95 41.52,86.5 SLAVE_PROG.4
FTD_RXD  (via drill 0.5)
  Top 0.406: v43.12,35.62 IC1.5
  Bottom 0.61: ST4.2 40.37,32.86 v43.12,35.62
FTD_TXD  (via drill 0.5)
  Top 0.406: v44.93,33.75 IC1.1
  Bottom 0.61: ST4.1 42.88,31.7 v44.93,33.75
GND  (via drill 0.5, 0.5 pad 0.41)  (1 unrouted)
  Top 0.406: IC1.26 36.04,26.7 35.2,26.7 v35.16,26.74 | IC1.21 34.3,29.56 34.3,27.6 v35.16,26.74 | IC1.18 31.61,29.62 v31.61,27.78 | IC1.7 42.31,36.64 v42.31,37.56 | X1-UPLINK/BEACON/DOWNLINK/ADC.6 26.26,91.44 22.66,91.44 X1-UPLINK/BEACON/DOWNLINK/ADC.12 | v35.16,26.74 IC1.25 | v35.16,26.74
  Top 1.016: X1-UPLINK/BEACON/DOWNLINK/ADC.12 19.56,93.55 19.56,95.25 26.14,101.83 X1-UPLINK/BEACON/DOWNLINK/ADC.G1
  Bottom 0.406: IC2-SLAVE.53 59.74,48.97 59.44,49.28 59.44,50.55 58.93,51.05 54.86,51.05 | IC2-SLAVE.63 67.74,46.56 68.07,46.23 68.83,46.23 70.61,48.01 v73.15,48.01 | IC2-SLAVE.22 64.54,33.51 v63.25,34.8
  Bottom 1.016: 52.35,108.2 X4-PREFLET.9 | 52.35,108.2 48.21,108.2 X4-PREFLET.G2 | 57.84,108.2 X4-PREFLET.11 | 52.35,108.2 57.84,108.2 | X4-PREFLET.13 63.33,108.2 57.84,108.2 | X3-RS232/GPS/MAGMET.5 12.69,69.58 X3-RS232/GPS/MAGMET.G2 | X1-UPLINK/BEACON/DOWNLINK/ADC.1 18,81.53 22.35,81.53 SLAVE_UART.1
  other vias: 50.8,5.08 45.72,5.08 48.26,10.16 48.26,15.24 50.8,20.32 55.88,20.32 60.96,20.32 66.04,20.32 66.04,15.24 66.04,10.16 66.04,5.08 60.96,5.08 71.12,5.08 76.2,5.08 81.28,5.08 86.36,10.16 86.36,15.24 91.44,15.24 91.44,20.32 86.36,20.32 81.28,20.32 76.2,20.32 71.12,20.32 76.2,25.4 76.2,30.48 71.12,25.4 81.28,25.4 86.36,25.4 96.52,25.4 96.52,20.32 96.52,30.48 96.52,35.56 96.52,40.64 96.52,45.47 101.6,35.56 106.68,40.64 106.68,45.72 106.68,50.8 106.68,55.88 101.6,60.96 96.52,66.04 91.44,76.2 96.52,76.2 101.6,76.2 101.6,71.12 101.6,66.04 101.6,81.28 96.52,81.28 91.44,81.28 86.36,81.28 86.36,76.2 86.36,86.36 91.44,86.36 96.52,86.36 101.6,86.36 106.68,86.36 111.76,81.28 111.76,76.2 111.76,71.12 111.76,66.04 86.36,96.52 91.44,96.52 96.52,96.52 91.44,101.6 81.28,111.76 35.56,5.08 35.56,10.16 35.56,25.4 25.4,20.32 25.4,25.4 20.32,40.64 25.4,45.72 5.08,35.56 15.24,25.4 15.24,30.48 40.64,40.64 45.72,40.64 45.72,45.72 45.72,35.56 45.72,30.48 55.88,25.4 50.8,50.8 55.88,50.8 57.15,35.56 57.15,40.64 57.15,45.72 40.64,50.8 35.56,50.8 35.56,45.72 40.64,45.72 40.64,55.88 40.64,60.96 50.8,60.96 55.88,60.96 60.96,66.04 76.2,60.96 35.56,66.04 35.56,71.12 35.56,76.2 40.64,76.2 25.4,60.96 15.24,60.96 15.24,66.04 15.24,71.12 15.24,76.2 15.24,50.8 15.24,45.72 20.32,71.12 86.36,55.88 81.28,55.88 81.28,60.96 81.28,66.04 60.96,71.12 76.2,86.87 45.72,106.68 40.64,106.68 35.56,106.68 30.48,101.6 40.64,101.6 45.72,96.52 40.64,96.52 45.72,86.36 35.56,96.52 66.04,86.36 56.13,86.36 60.96,86.36 71.12,81.28 66.04,81.28 66.04,76.2 51.05,81.28 71.12,71.12 91.44,35.56 52.07,13.97 57.15,13.97
  pour Top (isolate 0.406): 1.48,31.99 1.48,82.5 31.99,113.52 83.01,113.52 113.52,83.01 113.52,31.99 82.5,1.48 31.99,1.48
  pour Bottom (isolate 0.406): 1.48,31.99 1.48,82.5 31.99,113.52 83.01,113.52 113.52,83.01 113.52,31.99 82.5,1.48 31.99,1.48
MAG_R
  Bottom 0.61: IC4-MAX3232.7 19.09,58.38 17.78,59.69 14.05,59.69 X3-RS232/GPS/MAGMET.3
MAG_T
  Bottom 0.61: IC4-MAX3232.8 17.82,54.66 16.51,53.34 14.94,53.34 X3-RS232/GPS/MAGMET.2
MISO_0
  Bottom 0.61: AVR_PROG.2 52.61,16.2 53.06,15.75 57.38,15.75 58.91,14.22 AVRISP_PROG.1
MISO_S
  Bottom 0.406: SLAVE_PROG.2 37.96,81.2 SLAVE_ISP.2 29.11,86.51 27.94,85.34 21.95,85.34 X1-UPLINK/BEACON/DOWNLINK/ADC.3
MOSI_0
  Top 0.61: AVR_PROG.1 50.1,8.05 51.28,6.86 55.73,6.86 56.37,7.5 AVRISP_PROG.4
MOSI_S
  Bottom 0.406: SLAVE_PROG.1 36.19,79.43 SLAVE_ISP.1 29.36,84.74 27.43,82.8 20.61,82.8 X1-UPLINK/BEACON/DOWNLINK/ADC.2
N$1
  Top 1.016: R6.2 LED5.C
N$2
  Top 0.406: IC1.23 37.42,30.83 38.26,30.83 42.3,26.79 42.3,25.35 R1.1
N$3
  Top 1.016: LED1.C 39.15,24.43 39.15,23.23 R1.2
N$4
  Top 0.406: IC1.22 37.3,31.64 38.7,31.64 46.79,23.56 46.79,22.3 R2.1
N$5
  Top 1.016: LED2.C 42.75,20.84 42.75,19.64 R2.2
N$6
  Top 1.016: LED3.A 45.66,11.34 R3.1
N$7
  Bottom 0.61: U$1.4 30.14,33.43 30.14,32.68 28.96,31.5 28.96,29.84 C2.1
N$8
  Top 1.016: R5.1 79.88,92.33 LED4.A
N$10
  Bottom 0.406: X4-PREFLET.8 70.19,90.85 80.44,80.59 80.44,71.12 SLAV_PROG.1 69.52,65.86 SLAV_UART.2
N$11
  Bottom 0.406: X4-PREFLET.7 67.44,91.56 78.94,80.06 78.94,72.14 SLAV_PROG.2 69.52,68.38 SLAV_UART.3
N$12
  Bottom 0.406: X4-PREFLET.6 64.7,92.27 77.47,79.5 77.47,73.15 SLAV_PROG.3
N$13
  Bottom 0.406: X4-PREFLET.5 61.96,87.14 SLAV_RST.5 75.18,73.91 SLAV_PROG.4
N$14
  Bottom 0.406: X4-PREFLET.1 50.98,87.05 44.53,80.59 44.53,70.36 MAST_PROG.1 54.69,65.86 MAST_UART.2
N$15
  Bottom 0.406: X4-PREFLET.2 53.73,87.76 46.02,80.06 46.02,71.37 MAST_PROG.2 54.69,68.38 MAST_UART.3
N$16
  Bottom 0.406: X4-PREFLET.3 56.47,88.47 47.5,79.5 47.5,72.39 MAST_PROG.3
N$17
  Bottom 0.406: X4-PREFLET.4 59.21,84.1 MAST_REST.2 49.02,73.91 MAST_PROG.4
N$18
  Top 0.61: 88.52,93.34 89.15,93.62 89.15,92.35 88.52,92.08 88.52,93.34
N$19
  Top 0.61: AVR_PROG.5 60.96,17.83 60.96,10.41 59.31,8.76 AVRISP_PROG.2
N$20
  Top 0.61: 90.04,93.85 90.68,94.13 90.68,92.86 90.04,92.58 90.04,93.85
N$21
  Top 0.61: 82.78,89.51 83.41,89.79 83.41,88.52 82.78,88.24 82.78,89.51
N$22
  Top 0.61: 81.25,88.65 81.89,89.03 81.89,87.76 81.25,87.38 81.25,88.65
N$23
  Top 1.016: LED6.C 23.37,47.98 R7.2
N$29
  Bottom 0.61: IC4-MAX3232.1 26.71,52.93 C7.2
N$30
  Bottom 0.61: C7.1 25.7,50 25.06,50.64 25.06,53.18 24.18,54.07 IC4-MAX3232.3
N$31
  Bottom 0.61: IC4-MAX3232.4 22.91,53.56 23.79,52.67 23.79,48.86 23.16,48.23 C9.2
N$32
  Bottom 0.61: IC4-MAX3232.5 21.64,51.41 C9.1
N$33
  Bottom 0.61: IC4-MAX3232.2 25.45,58.13 26.7,59.39 C11.2
N$34
  Bottom 0.61: IC4-MAX3232.6 20.36,51.66 C10.2
PCHARGE
  Top 1.524: 14.73,34.03 20.32,28.44 J2.PWR | 14.73,34.03 S1-SLAVEPOWER.1 | C6.+ 9.9,32 12.7,32 14.73,34.03
  Bottom 1.016: 67.56,105.19 X4-PREFLET.14 | 67.56,109.73 67.56,105.19 | 67.56,105.19 X4-PREFLET.15
  Bottom 1.524: 67.56,109.73 66.04,111.25 33.02,111.25 4.06,82.3 4.06,41.66 7.62,38.1 10.66,38.1 S1-SLAVEPOWER.1
PE0_0  (via drill 0.5)
  Top 0.305: v64.57,42.54 64.57,38.22 67.99,34.8 SK1.2
  Bottom 0.305: v64.57,42.54 67.23,45.2 IC2-SLAVE.2
  Bottom 0.406: SK1.2 74.95,32.26 78.66,32.26 | 78.66,32.26 UC_PROG.1 | 78.66,32.26 78.66,30.3 82.04,26.92 UC_UART.2
PE1_0  (via drill 0.5)
  Top 0.305: v66.09,41.52 66.09,38.73 68.89,35.94 73.46,35.94 74.22,35.17 77.06,35.17 SK1.3
  Bottom 0.305: v66.09,41.52 68.97,44.4 IC2-SLAVE.3
  Bottom 0.406: SK1.3 79.49,35.6 UC_PROG.2 84.53,39.93 85.34,39.12 85.34,30.96 UC_UART.3
PFCHECK
  Top 0.61: X4-PREFLET.12 60.59,108.97 62.23,110.61 75.82,110.61 S3.2 84.33,102.1 84.33,100.08 82.26,98.01 LED4.C 79.88,98.04 77.22,98.04
  Top 1.016: R4.1 77.22,97.92 77.22,98.04
PGC
  Top 0.61: PICKIT_PROG.2 PIC_PROG.2
PGD
  Top 0.61: PICKIT_PROG.3 PIC_PROG.3
POWER
  Bottom 1.016: PICKIT_PROG.5 PIC_PROG.5
POWER_S
  Top 1.016: LED6.A 16.28,44.48 13.21,41.4 13.21,39.15 S1-SLAVEPOWER.2
  Bottom 0.61: U$1.1 29.61,39.37 28.98,39.37 25.68,36.07 | 25.68,36.07 U$1.5 | 25.68,36.07 23.41,36.07 C3.+
  Bottom 1.016: X1-UPLINK/BEACON/DOWNLINK/ADC.14 X1-UPLINK/BEACON/DOWNLINK/ADC.13 | X1-UPLINK/BEACON/DOWNLINK/ADC.14 X1-UPLINK/BEACON/DOWNLINK/ADC.15 | X1-UPLINK/BEACON/DOWNLINK/ADC.14 | S1-SLAVEPOWER.2 15.53,36.83 20.82,36.83 C3.+
  Bottom 1.524: S1-SLAVEPOWER.2 11.21,41.15 9.14,41.15 7.11,43.18 7.11,62.45 | 7.11,62.45 X3-RS232/GPS/MAGMET.9 | X1-UPLINK/BEACON/DOWNLINK/ADC.14 24.35,96.52 22.86,96.52 7.11,80.77 7.11,62.45
POWER_UC  (via drill 0.5)
  Top 0.406: 65.66,56.77 65.66,53.98 65.02,53.34 65.02,50.19 SK1.21
  Top 0.61: UC_PROG.5 84.12,47.45 91.64,39.93 UC_ISP.5 | SK1.21 65.34,47.37 v63.85,45.88 62.03,44.06 v62.03,37.21 | 65.66,56.77 67.39,58.5 R113.1
  Top 1.016: R113.1 71.29,56.72 72.14,55.88 77.22,55.88 80.01,53.09 80.01,48.77 81.33,47.45 UC_PROG.5 | 65.66,56.77 53.21,56.77 52.8,56.36 51.56,56.36 | 51.56,56.36 LED5.A | 51.56,56.36 S6_UCPOWER.2
  Bottom 0.406: IC2-SLAVE.52 58.94,46.22 59.18,45.97 63.75,45.97 v63.85,45.88 | SK1.52 60.05,28.7 65.02,28.7 65.79,29.46 65.79,30.73 65.34,31.18 IC2-SLAVE.21 65.34,33.9 v62.03,37.21
RST0
  Bottom 0.61: AVR_PROG.4 57.64,18.03 61.06,14.61 61.06,8.13 59.79,6.86 52.3,6.86 51.41,7.75 51.41,10.67 52.04,11.3 AVRISP_PROG.5
RST_S  (via drill 0.5)
  Top 0.61: v19.3,79.76 23.24,83.69 | 23.24,83.69 29.62,90.07 SLAVE_ISP.4 | SLAVE_DATA.1 30.75,76.18 23.24,83.69
  Bottom 0.61: v19.3,79.76 16.76,79.76 14.73,81.79 14.73,83.51 X1-UPLINK/BEACON/DOWNLINK/ADC.9
RX1_0
  Bottom 0.61: IC4-MAX3232.9 17.82,67.1 18.8,68.07 28.79,68.07 ST3.2
RXD_S
  Top 0.406: SLAVE_UART.2 19.07,77.2 12.45,83.82 12.45,85.34 15.49,88.39 16.96,88.39 X1-UPLINK/BEACON/DOWNLINK/ADC.10
  Bottom 0.406: SLAVE_UART.2 SLAVE_DATA.2
SCK0
  Top 0.61: AVR_PROG.3 55.1,13.71 56.37,12.44 AVRISP_PROG.3
SCK_S
  Bottom 0.406: X1-UPLINK/BEACON/DOWNLINK/ADC.4 23.79,87.38 27.94,87.38 28.84,88.27 SLAVE_ISP.3 39.72,82.97 SLAVE_PROG.3
TX1_0
  Bottom 0.61: IC4-MAX3232.10 19.09,65.83 19.81,66.55 27.8,66.55 ST3.3
TXD_S
  Top 0.406: SLAVE_UART.3 19.32,75.42 10.92,83.82 10.92,86.36 15.24,90.68 18.55,90.68 X1-UPLINK/BEACON/DOWNLINK/ADC.11
  Bottom 0.406: SLAVE_UART.3 SLAVE_DATA.3
UC_DCLK  (via drill 0.5)
  Top 0.305: SK1.6 76.95,37.46 74.22,37.46 73.21,38.48 68.38,38.48 67.62,39.24 v67.62,40.76
  Top 0.406: SK1.6 78.86,38 UC_DATA.3
  Bottom 0.305: IC2-SLAVE.6 68.86,42 v67.62,40.76
UC_DIO
  Top 0.406: SK1.7 75.26,39.12 80.01,39.12 92.2,26.92 UC_DATA.2
  Bottom 0.305: IC2-SLAVE.7 71.75,41.2 72.12,40.83 73.14,40.83 74.95,39.02 SK1.7
UC_LOCK
  Top 0.406: UC_DATA.1 86.36,35.53 86.36,40.13 85.34,41.15 83.06,41.15 82.55,41.66 77.22,41.66 75.67,40.11 72.92,40.11 SK1.8
  Bottom 0.305: IC2-SLAVE.8 71.61,40.4 SK1.8
UC_MISO  (via drill 0.5)
  Top 0.305: v63.81,38.22 63.81,43.05 66.35,45.59 72.96,45.59 SK1.13
  Bottom 0.305: IC2-SLAVE.13 65.63,36.4 v63.81,38.22 | 76.13,44.32 75.41,43.6 SK1.13
  Bottom 0.406: 76.13,44.32 76.13,49.07 78.88,51.82 92.96,51.82 93.98,50.8 93.98,48.77 92.66,47.45 UC_ISP.2
UC_MOSI  (via drill 0.5)
  Top 0.305: v65.33,38.73 65.33,42.03 66.35,43.05 73.46,43.05 73.97,42.54 77.23,42.54 SK1.12
  Bottom 0.305: v65.33,38.73 66.86,37.2 IC2-SLAVE.12
  Bottom 0.406: SK1.12 83.46,48.77 91.26,48.77 UC_ISP.1
UC_RST  (via drill 0.5)
  Top 0.305: v63.05,43.56 66.6,47.11 66.6,51.18
  Top 0.406: UC_PROG.4 81.58,44.96 77.65,48.89 74.1,48.89 71.81,51.18 71.3,51.18 | SK1.20 66.14,51.64 66.6,51.18 | 71.3,51.18 v71.3,53.27 | 66.6,51.18 71.3,51.18 | 66.6,51.18
  Top 0.61: R113.2 74.85,58.5 v75.69,57.66
  Top 1.016: C113.2 74.09,60.96 R113.2
  Bottom 0.305: IC2-SLAVE.20 66.14,34.62 63.05,37.72 v63.05,43.56
  Bottom 0.406: v71.3,53.27 v75.69,57.66
UC_SCK  (via drill 0.5)
  Top 0.305: v66.86,39.24 66.86,41.27 67.59,42 SK1.11
  Bottom 0.305: IC2-SLAVE.11 68.09,38 v66.86,39.24
  Bottom 0.406: SK1.11 72.83,42.42 75.69,42.42 76.45,41.66 79.76,41.66 80.52,42.42 UC_PROG.3 86.36,44.96 UC_ISP.3
UC_SS  (via drill 0.5)
  Top 0.305: v68.38,39.49 68.38,40.26 68.89,40.76 74.51,40.76 SK1.10
  Bottom 0.305: IC2-SLAVE.10 69.07,38.8 v68.38,39.49
  Bottom 0.406: SK1.10 77.03,39.12 79.76,39.12 81.79,41.15 91.19,41.15 UC_ISP.4
USB_DM
  Top 0.406: IC1.16 30.14,30 30.14,17.31 X1.2
USB_DP
  Top 0.406: IC1.15 27.69,28.45 27.69,16.94 X1.3
VPP
  Top 0.61: PIC_PROG.4 75.69,13.72 70.69,8.71 PICKIT_PROG.6
XTL1  (via drill 0.5)
  Top 0.305: v60.25,35.68 60.25,45.08 62.94,47.77 SK1.24
  Bottom 0.305: v60.25,35.68 62.94,33 IC2-SLAVE.24
  Bottom 0.406: Q2.1 C51.2 60.84,57.15 60.84,54.48 62.48,52.83 62.48,50.33 SK1.24
XTL2  (via drill 0.5)
  Top 0.305: v61.02,44.57 64.06,47.62 64.06,52.09 SK1.23
  Bottom 0.305: v61.02,44.57 61.02,35.94 63.74,33.21 IC2-SLAVE.23
  Bottom 0.406: Q2.2 C52.2 65.79,57.15 65.79,54.46 SK1.23
(copper drawn outside any net)
  shapes: Top circle x1

### Text on the board
Top: Top | IITB Pratham
Bottom: Bottom | Hus-SatPreflight | Flight_18_2_12
tPlace: Top | IITB Pratham
bPlace: Bottom | Hus-SatPreflight | Flight_18_2_12